# EAGLE schematic minimal signal interface (EAGLE 8.1.0)
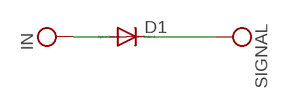
[diagram p0: schematic, sheet 1]

## Parts
D1  1N4148DO35-10  [DO35-10]

## Nets
VCC: D1.A D1.C ; supply symbol labelled IN, SIGNAL

## Library data of the parts
D1 = diode:1N4148: DIODE high speed (Philips)